# EasyEDA schematic esp32-hub75-driver-schem.json
TITLE: Sheet_1; REV: 1.0; Date: 2019-10-07; Sheet: 1/1; Drawn By: rorosaurus; Company: Your Company
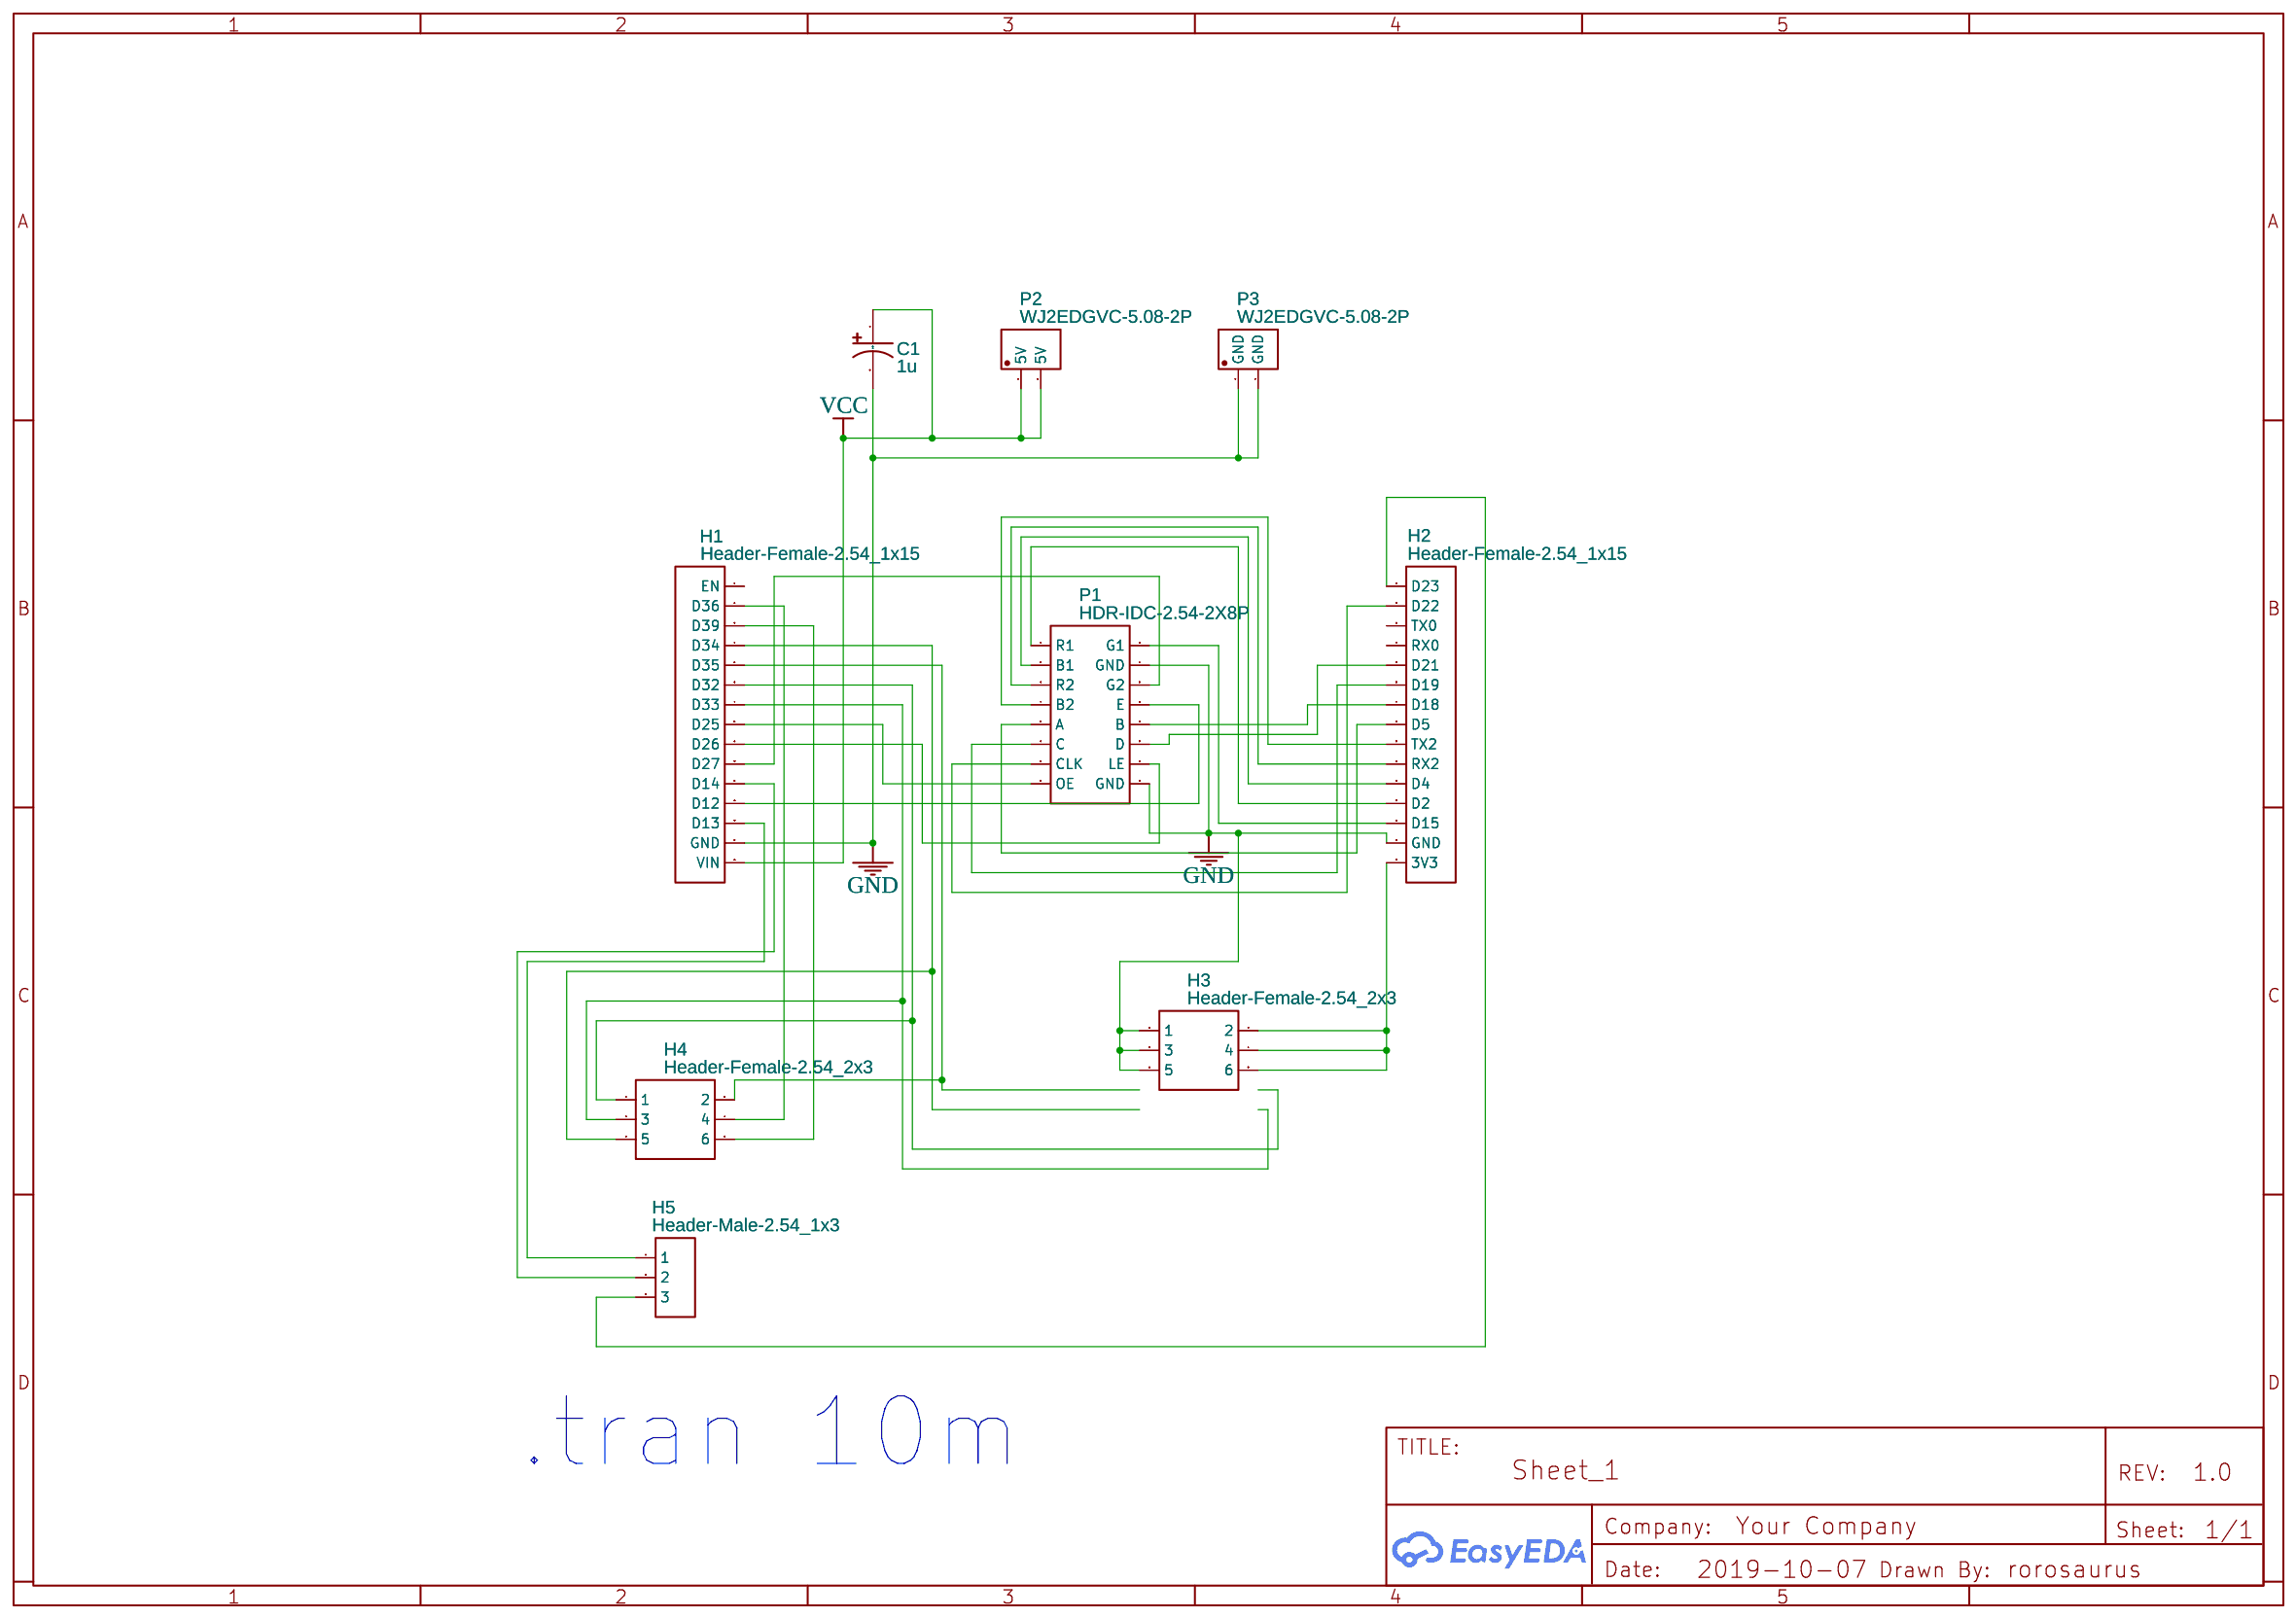
[diagram p0: schematic sheet]

## Parts
C1  1u  [CAP-D10.0XF5.0]
H1  Header-Female-2.54_1x15  [DIP-1X15P2.54]
H2  Header-Female-2.54_1x15  [DIP-1X15P2.54]
H3  Header-Female-2.54_2x3  [HDR-3X2/2.54]
H4  Header-Female-2.54_2x3  [HDR-3X2/2.54]
H5  Header-Male-2.54_1x3  [HDR-TH_3P-P2.54-V]
P1  HDR-IDC-2.54-2X8P  [HDR-IDC-2.54-2X8P]
P2  WJ2EDGVC-5.08-2P  [WJ2EDGVC-5.08-2P]
P3  WJ2EDGVC-5.08-2P  [WJ2EDGVC-5.08-2P]

## Library data of the parts
C1 = Cap_Electrolytic(TH)_D10.0XF5.0_US
H1 H2 = -: Supplier: LCSC; Manufacturer: Ckmtw; Manufacturer Part: 220S-1*15P H=8.5MM Ytype Gold-plated; Supplier Part: C124408
H3 H4 = -: Supplier: LCSC; Manufacturer: CONNFLY; Manufacturer Part: DS1023-2*3SF11; Contributor: LCSC; Supplier Part: C92272
H5 = -: Supplier: LCSC; Manufacturer: BOOMELE; Manufacturer Part: Header2.54mm 1*3P; image: //image.lceda.cn/szlcsc/C49257.jpg; Supplier Part: C49257
P1 = -: Supplier: LCSC; Manufacturer: BOOMELE; Manufacturer Part: IDC Box 2.54mm 16P　Straight; image: //image.lceda.cn/szlcsc/C3406.jpg; Supplier Part: C3406
P2 P3 = -: Supplier: LCSC; Manufacturer: ReliaPro; image: //image.lceda.cn/szlcsc/C8445.jpg; Supplier Part: C8445

## Nets
GND: C1.2 H1.14(GND) H2.14(GND) H3.1 H3.3 H3.5 P1.4(GND) P1.16(GND) P3.1(GND) P3.2(GND)
VCC: C1.1 H1.15(VIN) P2.1(5V) P2.2(5V)
Net-(H1-2): H1.2(D36) H4.4
Net-(H1-3): H1.3(D39) H4.6
Net-(H1-4): H1.4(D34) H4.5
Net-(H1-5): H1.5(D35) H4.2
Net-(H1-6): H1.6(D32) H4.1
Net-(H1-7): H1.7(D33) H4.3
Net-(H1-8): H1.8(D25) P1.15(OE)
Net-(H1-9): H1.9(D26) P1.14(LE)
Net-(H1-10): H1.10(D27) P1.6(G2)
Net-(H1-11): H1.11(D14) H5.2
Net-(H1-12): H1.12(D12) P1.8(E)
Net-(H1-13): H1.13(D13) H5.1
Net-(H2-1): H2.1(D23) H5.3
Net-(H2-2): H2.2(D22) P1.13(CLK)
Net-(H2-5): H2.5(D21) P1.12(D)
Net-(H2-6): H2.6(D19) P1.11(C)
Net-(H2-7): H2.7(D18) P1.10(B)
Net-(H2-8): H2.8(D5) P1.9(A)
Net-(H2-9): H2.9(TX2) P1.7(B2)
Net-(H2-10): H2.10(RX2) P1.5(R2)
Net-(H2-11): H2.11(D4) P1.3(B1)
Net-(H2-12): H2.12(D2) P1.1(R1)
Net-(H2-13): H2.13(D15) P1.2(G1)
Net-(H2-15): H2.15(3V3) H3.2 H3.4 H3.6

Not connected (* = marked no-connect by the designer): H1 1(EN); H2 3(TX0) 4(RX0)

## Notes on the sheet
- .tran 10m
